# EAGLE design VentillatorCircuit (EAGLE 9.6.1)
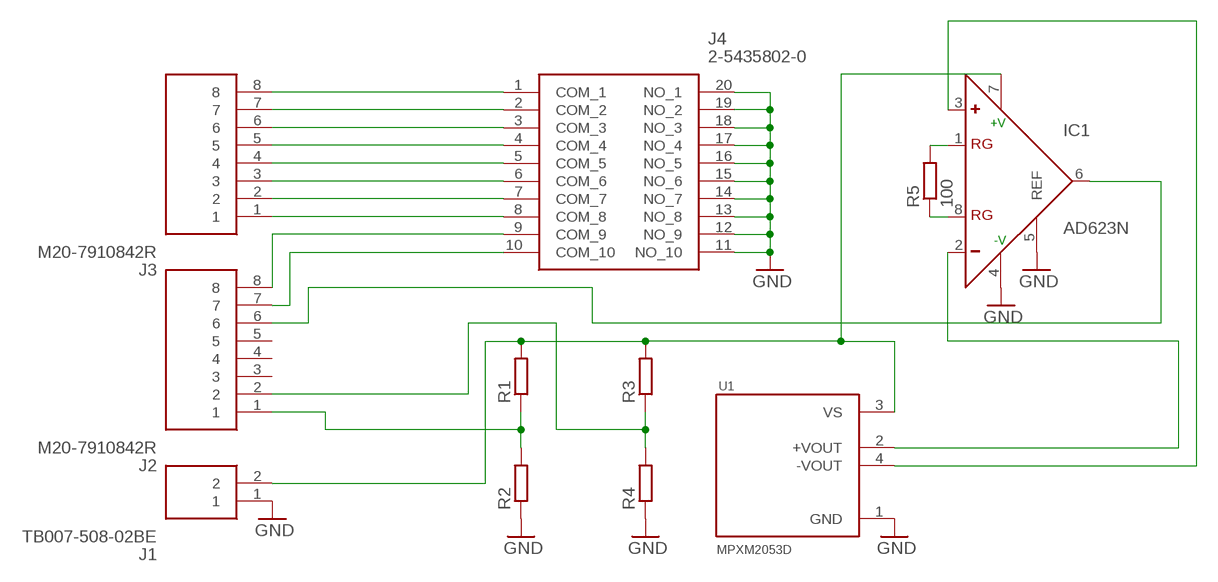
[diagram p0: schematic, sheet 1]

## Parts
IC1  AD623N  [DIL08]
J1  TB007-508-02BE  [TB00750802BE]
J2  M20-7910842R  [M207910842R]
J3  M20-7910842R  [M207910842R]
J4  2-5435802-0  [254358020]
R1  R-EU_0207/12  [0207/12]
R2  R-EU_0207/12  [0207/12]
R3  R-EU_0207/12  [0207/12]
R4  R-EU_0207/12  [0207/12]
R5  100  R-EU_0207/12  [0207/12]
U1  MPXM2053D  [SOT127P1219X419-5N]

## Nets
GND: IC1.4(-V) IC1.5(REF) J1.1 J4.11(NO_10) J4.12(NO_9) J4.13(NO_8) J4.14(NO_7) J4.15(NO_6) J4.16(NO_5) J4.17(NO_4) J4.18(NO_3) J4.19(NO_2) J4.20(NO_1) R2.1 R4.1 U1.1(GND)
N$1: J3.8 J4.1(COM_1)
N$2: J3.7 J4.2(COM_2)
N$3: J3.6 J4.3(COM_3)
N$4: J3.5 J4.4(COM_4)
N$5: J3.4 J4.5(COM_5)
N$6: J3.3 J4.6(COM_6)
N$7: J3.2 J4.7(COM_7)
N$8: J3.1 J4.8(COM_8)
N$9: J2.8 J4.9(COM_9)
N$10: J2.7 J4.10(COM_10)
N$11: J2.1 R1.1 R2.2
N$12: J2.2 R3.1 R4.2
N$13: IC1.1(RG) R5.2
N$14: IC1.8(RG) R5.1
N$16: IC1.3(+) U1.4(-VOUT)
N$17: IC1.2(-) U1.2(+VOUT)
N$18: IC1.7(+V) J1.2 R1.2 R3.2 U1.3(VS)
N$19: IC1.6(OUT) J2.6
Unconnected: J2.3 J2.4 J2.5

## Library data of the parts
IC1 = analog-devices:AD623: Single-Supply, Rail-to-Rail, Low Cost Instrumentation Amplifier Source: http://www.analog.com/static/imported-files/data_sheets/AD623.pdf; MF: ALTERA CORPORATION; MPN: AD623ANZ; OC_FARNELL: 9603700; OC_NEWARK: 59K4402
J1 = SamacSys_Parts:TB007-508-02BE: Fixed Terminal Blocks screw type, 5.08 , horizontal, 2 poles, CUI Blue, slotted screw, PCB mount Source: Datasheet; DESCRIPTION: Fixed Terminal Blocks screw type, 5.08 , horizontal, 2 poles, CUI Blue, slotted screw, PCB mount; HEIGHT: 14mm; MANUFACTURER_NAME: CUI Devices; MANUFACTURER_PART_NUMBER: TB007-508-02BE; MOUSER_PART_NUMBER: 490-TB007-508-02BE; MOUSER_PRICE-STOCK: https://www.mouser.co.uk/ProductDetail/CUI-Devices/TB007-508-02BE?qs=vLWxofP3U2y6PFKAfCqKUQ%3D%3D
J2 J3 = SamacSys_Parts:M20-7910842R: Headers & Wire Housings 8 WAY SIL HORIZ SMT SKT T&R Source: Datasheet <https://cdn.harwin.com/pdfs/M20-791R.pdf>; DESCRIPTION: Headers & Wire Housings 8 WAY SIL HORIZ SMT SKT T&R; HEIGHT: 2.65mm; MANUFACTURER_NAME: HARWIN; MANUFACTURER_PART_NUMBER: M20-7910842R; MOUSER_PART_NUMBER: 855-M20-7910842R; MOUSER_PRICE-STOCK: https://www.mouser.co.uk/ProductDetail/Harwin/M20-7910842R?qs=k41KVqW3ympJ6ZCQNkwKKw%3D%3D
J4 = SamacSys_Parts:2-5435802-0: DIP Switches / SIP Switches 10 POS SIDE ACT SLD Source: Datasheet <https://www.te.com/commerce/DocumentDelivery/DDEController?Action=srchrtrv&DocNm=5435802&DocType=Customer Drawing&DocLang=English>; DESCRIPTION: DIP Switches / SIP Switches 10 POS SIDE ACT SLD; HEIGHT: 7.874mm; MANUFACTURER_NAME: TE Connectivity; MANUFACTURER_PART_NUMBER: 2-5435802-0; MOUSER_PART_NUMBER: 506-2-5435802-0; MOUSER_PRICE-STOCK: https://www.mouser.com/Search/Refine.aspx?Keyword=506-2-5435802-0
R1-R5 = rcl:R-EU_: RESISTOR, European symbol; SPICEPREFIX: R
U1 = MPXM2053D:MPXM2053D: Pressure Sensor 7.25PSI (50kPa) Differential 0 mV ~ 40 mV (10V) 5-SMD Module; AVAILABILITY: Unavailable; DESCRIPTION: Pressure Sensor 7.25PSI _50kPa_ Differential 0 mV ~ 40 mV _10V_ 5-SMD Module; MF: Freescale Semiconductor; MP: MPXM2053D; PACKAGE: SMD-5 Freescale Semiconductor; PRICE: None

## Board
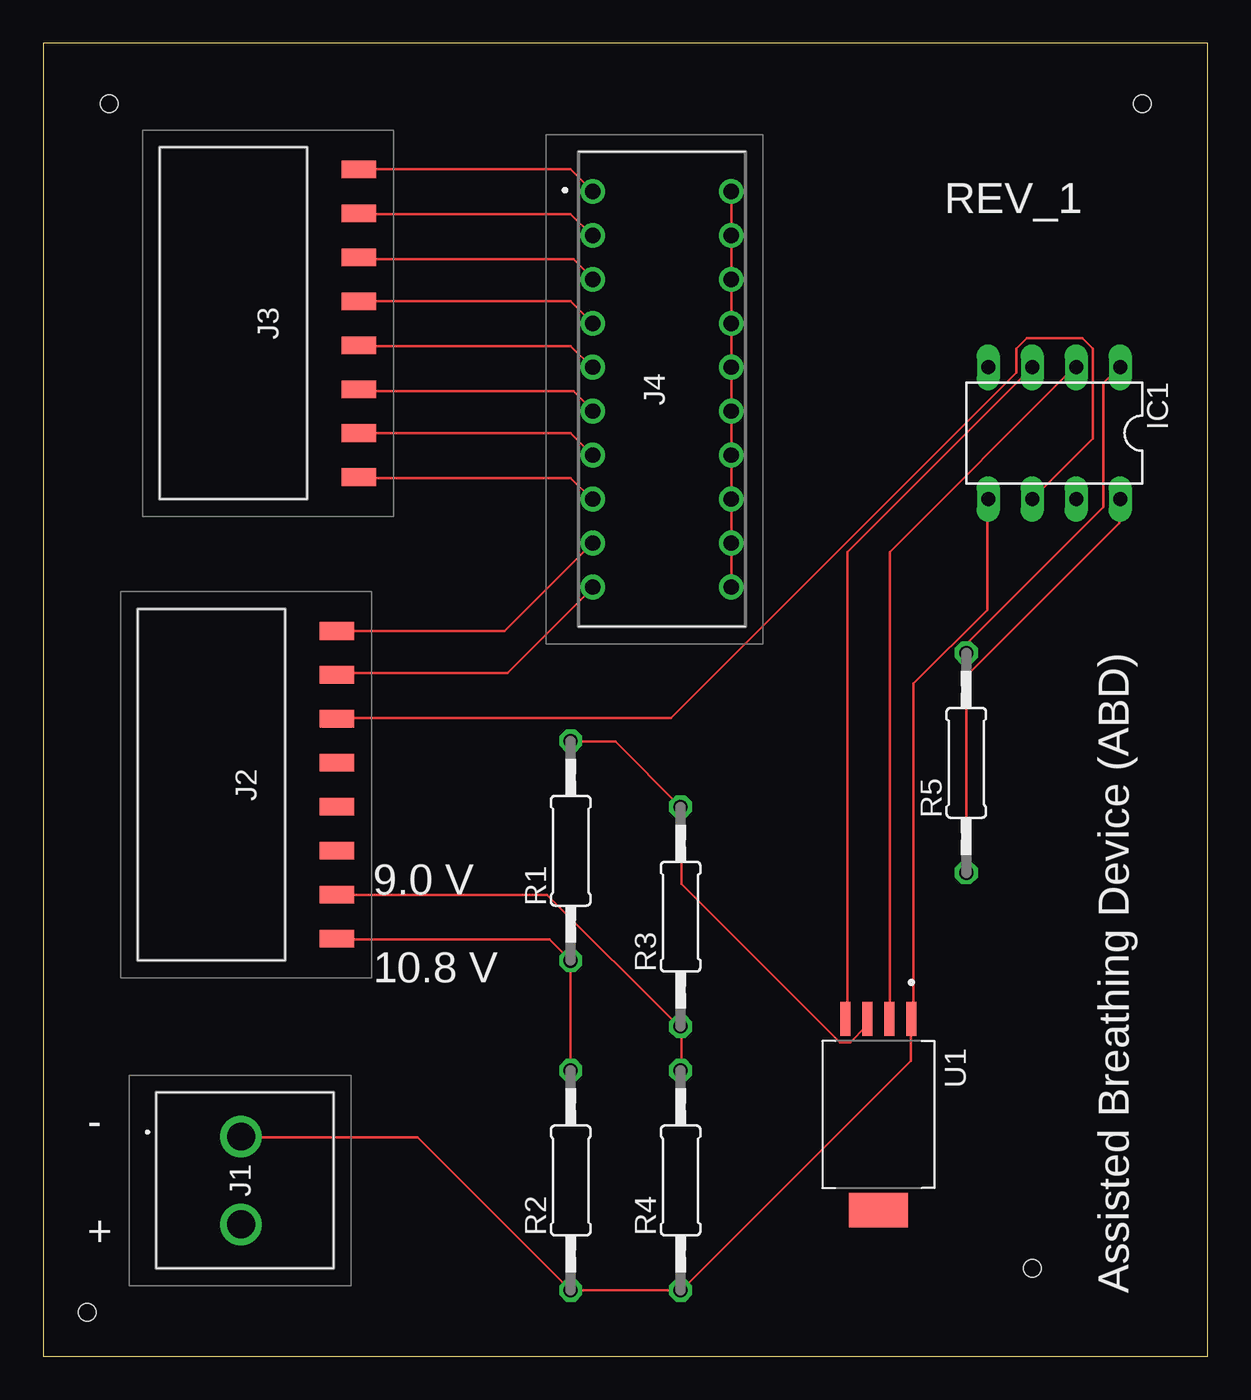
[diagram p1: board, top side]
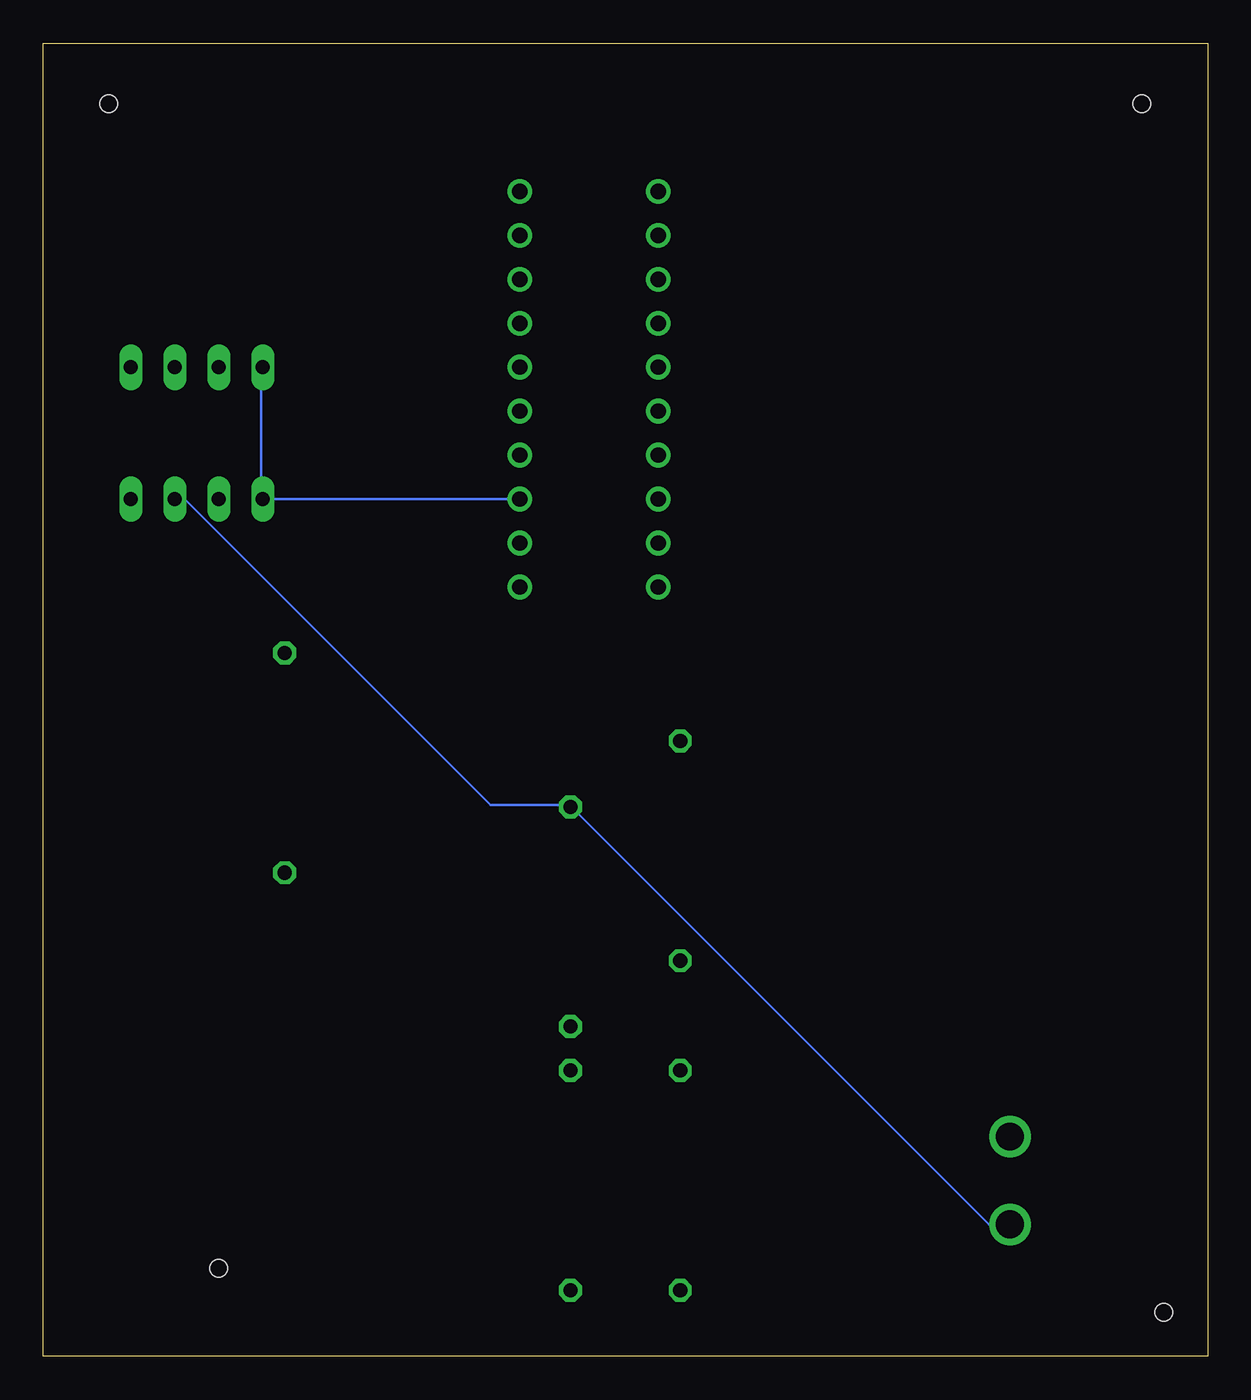
[diagram p2: board, bottom side, seen from below]

Size 67.29 x 75.87 mm. Coordinates in mm from the lower left corner, seen from the top.
Outline: 0,0 67.29,0 67.29,75.87 0,75.87 0,0
Copper layers (1*16): Top 0.035mm / dielectric 1.5mm / Bottom 0.035mm
Design rules "default": minimum track width 6mil, minimum drill 0.35mm, track to track 6mil, track to pad 6mil, pad to pad 6mil, via to via 6mil, smd to smd 6mil, copper to edge 40mil, drill to drill 6mil, minimum pad ring 10mil, minimum via ring 8mil, stop-mask expansion 4mil, vias tented up to drill 0mil, thermal gap 10mil
Holes 1 mm at 3.81,72.39 63.5,72.39 57.15,5.08 2.54,2.54

### Footprints (pad centres in the part's own frame; a part is rotated, then mirrored left to right if it is on the bottom)
DIL08 = drill 0.813 long: 1 -3.81,-3.81; 2 -1.27,-3.81; 3 1.27,-3.81; 4 3.81,-3.81; 5 3.81,3.81; 6 1.27,3.81; 7 -1.27,3.81; 8 -3.81,3.81
TB00750802BE = drill 1.6 pad 2.4: 1 0,0; 2 5.08,0
M207910842R = smd 1.02 x 2: 1 -8.89,-3; 2 -6.35,-3; 3 -3.81,-3; 4 -1.27,-3; 5 1.27,-3; 6 3.81,-3; 7 6.35,-3; 8 8.89,-3
254358020 = drill 0.88 pad 1.43: 1 0,0; 2 2.54,0; 3 5.08,0; 4 7.62,0; 5 10.16,0; 6 12.7,0; 7 15.24,0; 8 17.78,0; 9 20.32,0; 10 22.86,0; 11 22.86,8.001; 12 20.32,8.001; 13 17.78,8.001; 14 15.24,8.001; 15 12.7,8.001; 16 10.16,8.001; 17 7.62,8.001; 18 5.08,8.001; 19 2.54,8.001; 20 0,8.001
0207/12 = drill 0.813 octagon: 1 -6.35,0; 2 6.35,0
SOT127P1219X419-5N = smd 1.98 x 0.57: 1 -5.53,1.905; 2 -5.53,0.635; 3 -5.53,-0.635; 4 -5.53,-1.905 | smd 1.98 x 3.39: 5 5.53,0

### Placement (x,y rotation side)
IC1  58.42,53.34 180 top
J1  11.43,12.7 270 top
J2  13.97,33.02 90 top
J3  15.24,59.69 90 top
J4  31.75,67.31 270 top
R1  30.48,29.21 90 top
R2  30.48,10.16 90 top
R3  36.83,25.4 90 top
R4  36.83,10.16 90 top
R5  53.34,34.29 90 top
U1  48.26,13.97 270 top

### Tracks (layer width: path | path; a pad name or v marks a point on that pad's centre or on a via)
GND
  Top 0.152: 39.78,64.77 39.78,67.21 J4.20 | 39.78,57.15 39.78,54.71 J4.15 39.78,54.56 39.78,52.12 J4.14 39.78,51.97 39.78,49.53 | J4.11 39.78,44.5 39.78,46.94 J4.12 39.78,47.09 39.78,49.53 | 39.78,49.53 J4.13 | 39.78,57.15 39.78,59.59 J4.17 39.78,59.74 39.78,62.18 J4.18 39.78,62.33 39.78,64.77 | 39.78,57.15 J4.16 | 39.78,64.77 J4.19 | J1.1 11.43,12.65 21.64,12.65 R2.1 R4.1 36.88,3.81 50.14,17.07 50.14,19.36 U1.1 50.29,19.51 50.29,38.86 54.56,43.13 54.56,49.53 IC1.5
  Bottom 0.152: IC1.4 54.71,57.15 54.71,49.53 IC1.5 J4.13
N$1
  Top 0.152: J3.8 30.48,68.58 J4.1
N$2
  Top 0.152: J3.7 18.29,65.99 30.48,65.99 31.7,64.77 J4.2
N$3
  Top 0.152: J3.6 18.29,63.4 30.63,63.4 31.7,62.33 J4.3
N$4
  Top 0.152: J3.5 30.48,60.96 J4.4
N$5
  Top 0.152: J3.4 18.29,58.37 30.48,58.37 31.7,57.15 J4.5
N$6
  Top 0.152: J3.3 18.29,55.78 30.63,55.78 31.7,54.71 J4.6
N$7
  Top 0.152: J3.2 30.48,53.34 J4.7
N$8
  Top 0.152: J3.1 18.29,50.75 30.48,50.75 31.7,49.53 J4.8
N$9
  Top 0.152: J2.8 26.67,41.91 J4.9
N$10
  Top 0.152: J2.7 17.07,39.47 26.82,39.47 31.7,44.35 J4.10
N$11
  Top 0.152: J2.1 17.07,24.08 29.26,24.08 R1.1 R2.2
N$12
  Top 0.152: J2.2 29.11,26.67 36.73,19.05 R3.1 36.88,19.05 36.88,16.61 R4.2
N$13
  Top 0.152: R5.2 53.34,41.15 61.27,49.07 61.27,56.24 62.18,57.15 IC1.1
N$14
  Top 0.152: R5.1 53.34,39.32 62.18,48.16 62.18,49.53 IC1.8
N$16
  Top 0.152: IC1.3 46.48,46.48 46.48,19.51 U1.4
N$17
  Top 0.152: U1.2 48.92,19.51 48.92,46.48 59.59,57.15 IC1.2
N$18
  Top 0.152: U1.3 47.55,19.36 47.55,19.05 46.63,18.14 46.02,18.14 36.88,27.28 36.88,31.7 R3.2 33.07,35.51 30.48,35.51 R1.2
  Bottom 0.152: IC1.7 59.13,49.53 41.45,31.85 36.88,31.85 R3.2 36.73,31.7 12.65,7.62 J1.2
N$19
  Top 0.152: IC1.6 60.66,53.03 60.66,58.22 60.05,58.83 56.84,58.83 56.24,58.22 56.24,56.84 36.27,36.88 17.07,36.88 J2.6

### Text on the board
tPlace: REV_1 | Assisted Breathing Device (ABD) | 9.0 V | 10.8 V | - | +